# Altium schematic sheet fan_temp.SchDoc
size 594 x 420 mm
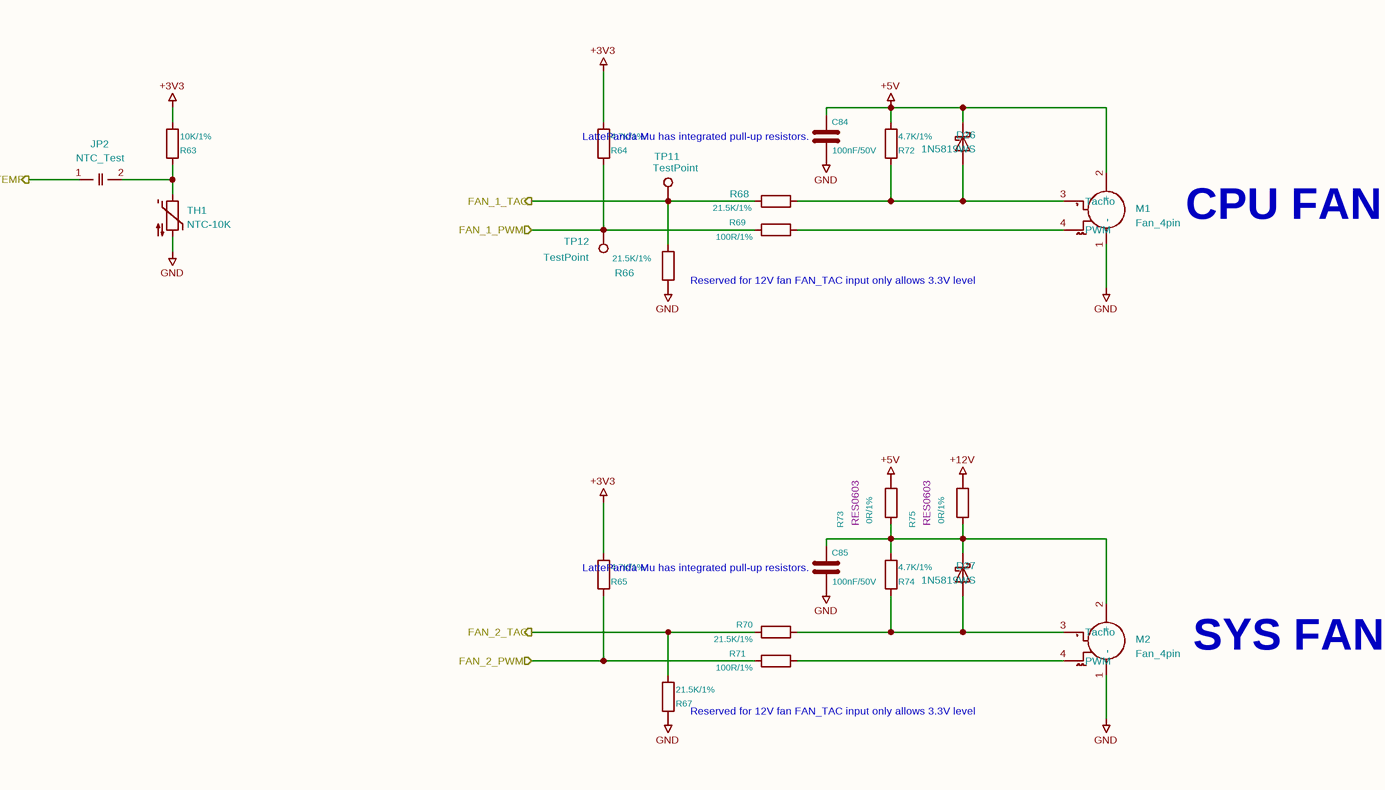
[diagram p0: fan_temp.SchDoc]

## Parts
C84  100nF/50V  [C_0402_1005Metric]
C85  100nF/50V  [C_0402_1005Metric]
D26  1N5819WS  [D_SOD-323]
D27  1N5819WS  [D_SOD-323]
JP2  NTC_Test  [SolderJumper-2_P1.3mm_Open_RoundedPad1.0x1.5mm]
M1  Fan_4pin  [JST_PH_B4B-PH-K_1x04_P2.00mm_Vertical]
M2  Fan_4pin  [JST_PH_B4B-PH-K_1x04_P2.00mm_Vertical]
R63  10K/1%  [R_0402_1005Metric]
R64  4.7K/1%  [R_0402_1005Metric]
R65  4.7K/1%  [R_0402_1005Metric]
R66  21.5K/1%  [R_0402_1005Metric]
R67  21.5K/1%  [R_0402_1005Metric]
R68  21.5K/1%  [R_0402_1005Metric]
R69  100R/1%  [R_0402_1005Metric]
R70  21.5K/1%  [R_0402_1005Metric]
R71  100R/1%  [R_0402_1005Metric]
R72  4.7K/1%  [R_0402_1005Metric]
R73  0R/1%  [RES0603]
R74  4.7K/1%  [R_0402_1005Metric]
R75  0R/1%  [RES0603]
TH1  NTC-10K  [R_0603_1608Metric]
TP11  TestPoint  [TestPoint_Pad_D1.5mm]
TP12  TestPoint  [TestPoint_Pad_D1.5mm]

## Ports
FAN_1_PWM (in), FAN_1_TAC (out), FAN_2_PWM (in), FAN_2_TAC (out), TEMP (out)

## Nets
+3V3: R63.1 R64.1 R65.1
+5V: C84.1 D26.1(K) M1.2(+) R72.1 R73.2
+12V: R75.2
GND: C84.2 C85.2 M1.1(-) M2.1(-) R66.2 R67.2 TH1.2
FAN_1_PWM: R64.2 R69.1 TP12.1 ; port FAN_1_PWM
FAN_1_TAC: R66.1 R68.2 TP11.1 ; port FAN_1_TAC
FAN_2_PWM: R65.2 R71.1 ; port FAN_2_PWM
FAN_2_TAC: R67.1 R70.1 ; port FAN_2_TAC
TEMP: JP2.1(A) ; port TEMP
NetC85_1: C85.1 D27.1(K) M2.2(+) R73.1 R74.1 R75.1
NetD26_2: D26.2(A) M1.3(Tacho) R68.1 R72.2
NetD27_2: D27.2(A) M2.3(Tacho) R70.2 R74.2
NetJP2_2: JP2.2(B) R63.2 TH1.1
NetM1_4: M1.4(PWM) R69.2
NetM2_4: M2.4(PWM) R71.2

## Notes on the sheet
- LattePanda Mu has integrated pull-up resistors.
- CPU FAN
- (near R66) Reserved for 12V fan
  FAN_TAC input only allows 3.3V level
- SYS FAN
- (near R67) Reserved for 12V fan
  FAN_TAC input only allows 3.3V level
- 1
- 2
- 3
- 4
- 5
- 6
- 7
- 8
- 9
- 10
- 11
- A
- B
- C
- D
- E
- F
- G
- H
- Title: Primer Carrier for LattePanda Mu
- File: fan_temp.kicad_sch
- Sheet: /
- DFRobot
- KiCad E.D.A.  kicad (5.1.4)-1
- Size: A2
- Date: 2024-03-13
- Rev: V1.0.0
- Id: 1/1

## Library data of the parts
C84 C85 = C: SCH_Show_Footprint: C0402; Value: 100nF/50V
  C84: Footprint: A_HDJ_Library:C_0402_1005Metric
  C85: Footprint: Capacitor_SMD:C_0402_1005Metric
D26 D27 = 1N5819WS: SCH_Show_Footprint: SOD-323; Value: 1N5819WS
  D26: Footprint: A_HDJ_Library:D_SOD-323
  D27: Footprint: Diode_SMD:D_SOD-323
JP2 = SolderJumper_2_Open: Value: NTC_Test; Footprint: Jumper:SolderJumper-2_P1.3mm_Open_RoundedPad1.0x1.5mm
R63-R75 = R
  R63: Value: 10K/1%; Footprint: Resistor_SMD:R_0402_1005Metric
  R64 R65 R74: Value: 4.7K/1%; Footprint: Resistor_SMD:R_0402_1005Metric
  R66 R67 R70: Value: 21.5K/1%; Footprint: Resistor_SMD:R_0402_1005Metric
  R68: Value: 21.5K/1%; Footprint: A_HDJ_Library:R_0402_1005Metric
  R69: Value: 100R/1%; Footprint: A_HDJ_Library:R_0402_1005Metric
  R71: Value: 100R/1%; Footprint: Resistor_SMD:R_0402_1005Metric
  R72: Value: 4.7K/1%; Footprint: A_HDJ_Library:R_0402_1005Metric
  R73 R75: Value: 0R/1%
TH1 = Thermistor_NTC: Value: NTC-10K; Footprint: Resistor_SMD:R_0603_1608Metric
M1 M2 = Fan_4pin: Value: Fan_4pin
  M1: Footprint: A_HDJ_Library:JST_PH_B4B-PH-K_1x04_P2.00mm_Vertical
  M2: Footprint: Connector_JST:JST_PH_B4B-PH-K_1x04_P2.00mm_Vertical
TP11 TP12 = TestPoint: Value: TestPoint; Footprint: A_HDJ_Library:TestPoint_Pad_D1.5mm